# Altium schematic sheet STLINK-SWD.SchDoc
size 209 x 297 mm
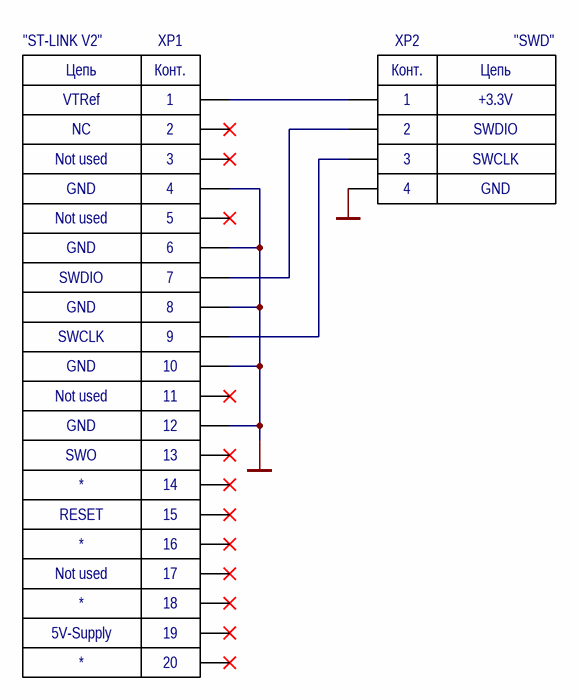
[diagram p0: STLINK-SWD.SchDoc]

## Parts
XP1  Label: "ST-LINK V2"  Circuit7: SWDIO  Circuit8: GND  Circuit9: SWCLK  Circuit11: Not used  Circuit13: SWO  Circuit15: RESET  Circuit19: 5V-Supply  Circuit2: NC  Circuit1: VTRef  [IDC-20MR]  (hidden comment: IDC-20MR)
XP2  Circuit4: GND  Circuit3: SWCLK  Circuit1: +3.3V  Circuit2: SWDIO  Label: "SWD"  [PLS-4R-left]  (hidden comment: PLS-4R)

## Nets
GND: XP1.4 XP1.6 XP1.8 XP1.10 XP1.12 XP2.4
NetXP1_1: XP1.1 XP2.1
NetXP1_7: XP1.7 XP2.2
NetXP1_9: XP1.9 XP2.3

Not connected (* = marked no-connect by the designer): XP1 2* 3* 5* 11* 13* 14* 15* 16* 17* 18* 19* 20*

## Notes on the sheet
- (in symbol IDC-20MR) Цепь; Конт.
- (in symbol PLS-4R) Конт.; Цепь

## Library data of the parts
XP1 = IDC-20MR: Box Header R/A type Pitch 2.54mm; Circuit10: GND; Circuit12: GND; Circuit14: *; Circuit16: *; Circuit17: Not used; Circuit18: *; Circuit20: *; Circuit6: GND; Circuit4: GND; Circuit5: Not used; Circuit3: Not used
XP2 = PLS-4R: Pin Header R/A type Pitch 2.54mm